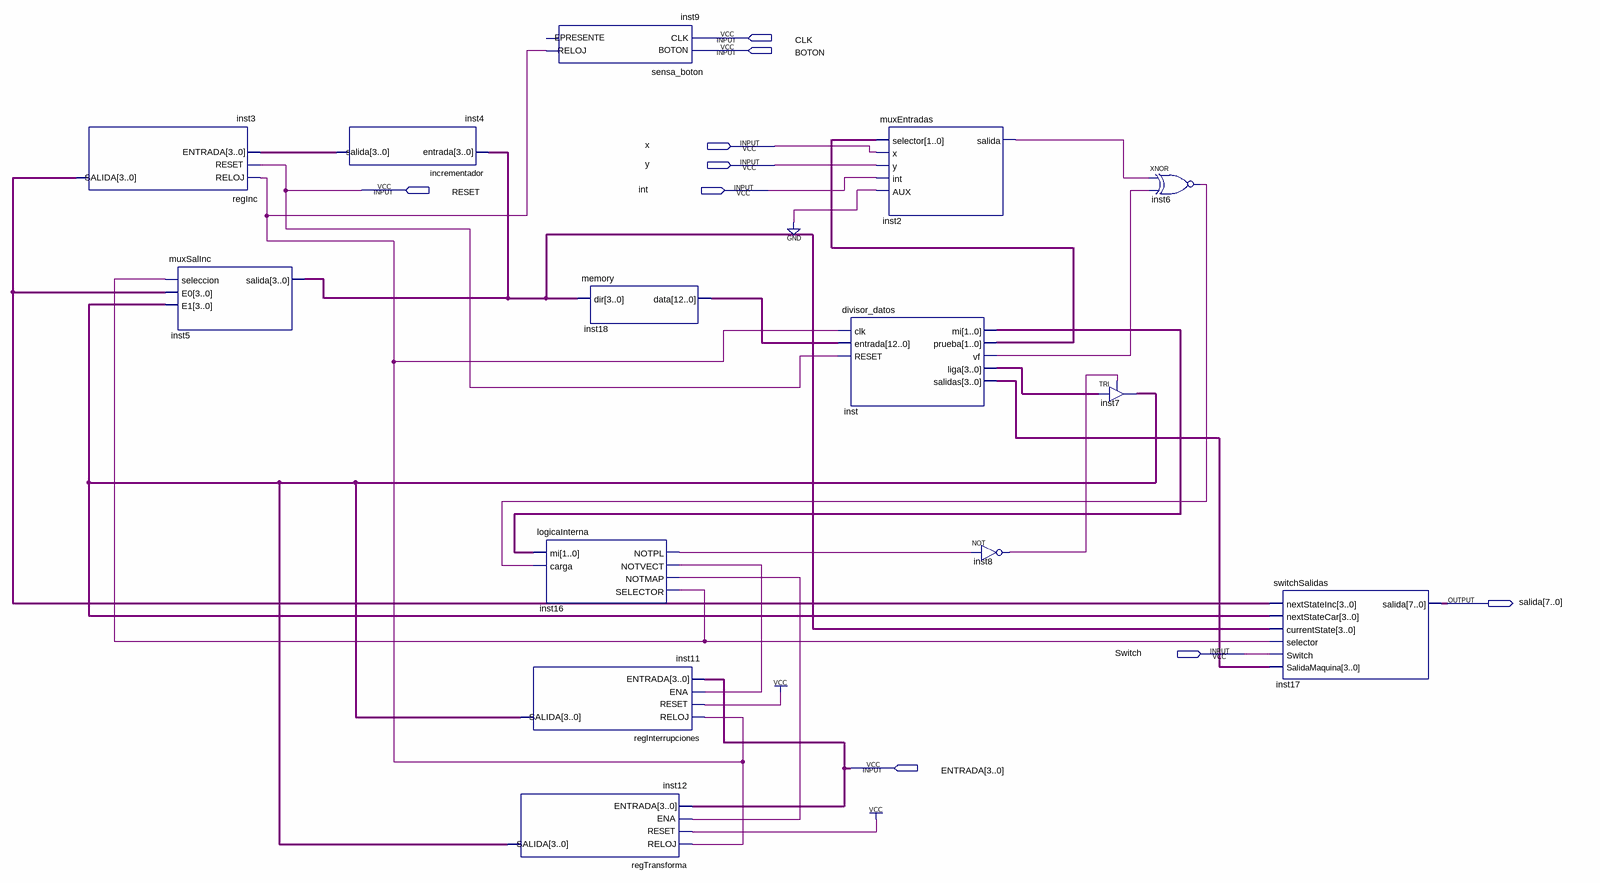
[diagram p0: schematic sheet]
// Quartus schematic Practica6.bdf as structural Verilog: 14 symbols, 9 pins
module Practica6 (
  input  CLK,
  input  BOTON,
  input  x,
  input  y,
  input  RESET,
  input  \int ,
  input  Switch,
  input  [3:0] ENTRADA,
  output [7:0] salida
);

  wire inst2_salida, inst6_out, inst8_out, inst9_reloj, inst16_notmap, inst16_notpl, inst16_notvect,
       inst16_selector, inst_vf;
  wire [1:0] inst_mi, inst_prueba;
  wire [3:0] inst3_salida, inst4_salida, inst5_salida, inst12_salida, inst_liga, inst_salidas;
  wire [12:0] inst18_data;

  regInc inst3 (.RELOJ(inst9_reloj), .RESET(RESET), .ENTRADA(inst4_salida), .SALIDA(inst3_salida));
  muxSalInc inst5 (.seleccion(inst16_selector), .E0(inst3_salida), .E1(inst12_salida), .salida(inst5_salida));
  incrementador inst4 (.entrada(inst5_salida), .salida(inst4_salida));
  regTransforma inst12 (
    .RELOJ(inst9_reloj), .RESET(1'b1), .ENA(inst16_notmap), .ENTRADA(ENTRADA), .SALIDA(inst12_salida));
  sensa_boton inst9 (.BOTON(BOTON), .CLK(CLK), .RELOJ(inst9_reloj));  // open: EPRESENTE
  logicaInterna inst16 (
    .mi(inst_mi), .carga(inst6_out), .NOTPL(inst16_notpl), .NOTVECT(inst16_notvect), .NOTMAP(inst16_notmap),
    .SELECTOR(inst16_selector));
  regInterrupciones inst11 (
    .RELOJ(inst9_reloj), .RESET(1'b1), .ENA(inst16_notvect), .ENTRADA(ENTRADA), .SALIDA(inst12_salida));
  memory inst18 (.dir(inst5_salida), .data(inst18_data));
  divisor_datos inst (
    .clk(inst9_reloj), .entrada(inst18_data), .RESET(RESET), .mi(inst_mi), .prueba(inst_prueba),
    .vf(inst_vf), .liga(inst_liga), .salidas(inst_salidas));
  muxEntradas inst2 (.selector(inst_prueba), .x(x), .y(y), .\int (\int ), .AUX(1'b0), .salida(inst2_salida));
  not inst8 (inst8_out, inst16_notpl);
  TRI inst7[3:0] (.IN(inst_liga), .OE(inst8_out), .OUT(inst12_salida));
  xnor inst6 (inst6_out, inst2_salida, inst_vf);
  switchSalidas inst17 (
    .nextStateInc(inst3_salida), .nextStateCar(inst12_salida), .currentState(inst5_salida),
    .selector(inst16_selector), .Switch(Switch), .SalidaMaquina(inst_salidas), .salida(salida));
endmodule
